# EAGLE schematic IR (EAGLE 9.4.2)
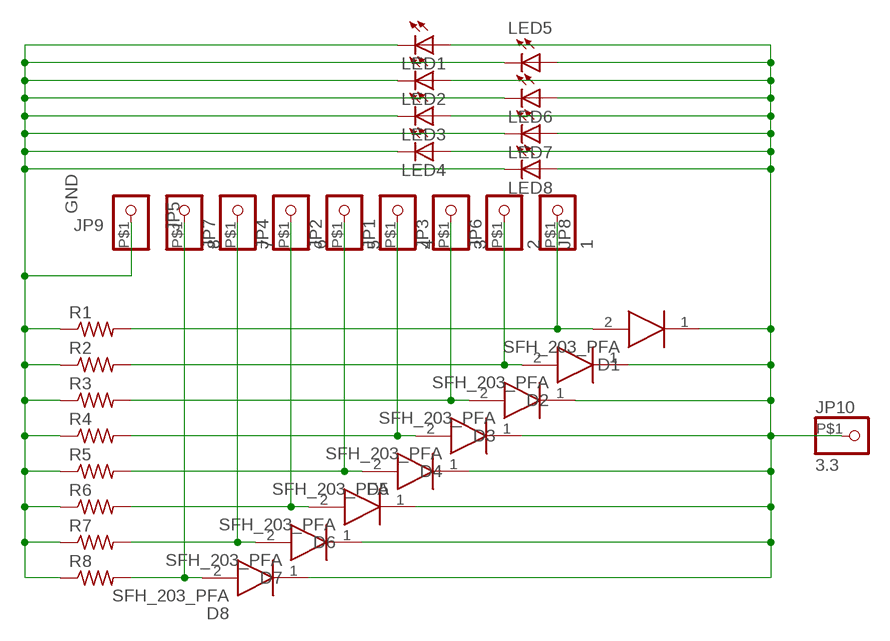
[diagram p0: schematic, sheet 1]

## Parts
D1  SFH_203_PFA  [SFH213_1]
D2  SFH_203_PFA  [SFH213_1]
D3  SFH_203_PFA  [SFH213_1]
D4  SFH_203_PFA  [SFH213_1]
D5  SFH_203_PFA  [SFH213_1]
D6  SFH_203_PFA  [SFH213_1]
D7  SFH_203_PFA  [SFH213_1]
D8  SFH_203_PFA  [SFH213_1]
JP1  4  PINHD-1X1-BIGPOGO  [1X1-BIGPOGO]
JP2  5  PINHD-1X1-BIGPOGO  [1X1-BIGPOGO]
JP3  3  PINHD-1X1-BIGPOGO  [1X1-BIGPOGO]
JP4  6  PINHD-1X1-BIGPOGO  [1X1-BIGPOGO]
JP5  8  PINHD-1X1-BIGPOGO  [1X1-BIGPOGO]
JP6  2  PINHD-1X1-BIGPOGO  [1X1-BIGPOGO]
JP7  7  PINHD-1X1-BIGPOGO  [1X1-BIGPOGO]
JP8  1  PINHD-1X1-BIGPOGO  [1X1-BIGPOGO]
JP9  GND  PINHD-1X1-BIGPOGO  [1X1-BIGPOGO]
JP10  3.3  PINHD-1X1-BIGPOGO  [1X1-BIGPOGO]
LED1  LED5MM  [LED5MM]
LED2  LED5MM  [LED5MM]
LED3  LED5MM  [LED5MM]
LED4  LED5MM  [LED5MM]
LED5  LED5MM  [LED5MM]
LED6  LED5MM  [LED5MM]
LED7  LED5MM  [LED5MM]
LED8  LED5MM  [LED5MM]
R1  R-US_0207/10  [0207/10]
R2  R-US_0207/10  [0207/10]
R3  R-US_0207/10  [0207/10]
R4  R-US_0207/10  [0207/10]
R5  R-US_0207/10  [0207/10]
R6  R-US_0207/10  [0207/10]
R7  R-US_0207/10  [0207/10]
R8  R-US_0207/10  [0207/10]

## Nets
N$1: D1.2(A) JP8.P$1 R1.2
N$2: D2.2(A) JP6.P$1 R2.2
N$3: D3.2(A) JP3.P$1 R3.2
N$4: D4.2(A) JP1.P$1 R4.2
N$5: D5.2(A) JP2.P$1 R5.2
N$6: D6.2(A) JP4.P$1 R6.2
N$7: D7.2(A) JP7.P$1 R7.2
N$8: D8.2(A) JP5.P$1 R8.2
N$9: D1.1(K) D2.1(K) D3.1(K) D4.1(K) D5.1(K) D6.1(K) D7.1(K) D8.1(K) JP10.P$1 LED1.A LED2.A LED3.A LED4.A LED5.A LED6.A LED7.A LED8.A
N$10: JP9.P$1 LED1.K(C) LED2.K(C) LED3.K(C) LED4.K(C) LED5.K(C) LED6.K(C) LED7.K(C) LED8.K(C) R1.1 R2.1 R3.1 R4.1 R5.1 R6.1 R7.1 R8.1

## Library data of the parts
D1-D8 = SFH_203_PFA:SFH_203_PFA: IR T-1 PIN Photodiode 150,SFH203PFA Osram Opto SFH 203 PFA IR Si Photodiode, 75 , Through Hole 5mm package Source: Datasheet <https://www.osram.com/media/resource/hires/osram-dam-2495938/SFH 203 PFA.pdf>; ALLIED_NUMBER: 70339002; ALLIED_PRICE-STOCK: https://www.alliedelec.com/osram-opto-semiconductors-sfh-203-pfa/70339002/; DESCRIPTION: IR T-1 PIN Photodiode 150,SFH203PFA Osram Opto SFH 203 PFA IR Si Photodiode, 75 , Through Hole 5mm package; HEIGHT: mm; MANUFACTURER_NAME: OSRAM Opto Semiconductors; MANUFACTURER_PART_NUMBER: SFH 203 PFA; MOUSER_PART_NUMBER: 720-SFH203PFA; MOUSER_PRICE-STOCK: https://www.mouser.com/Search/Refine.aspx?Keyword=720-SFH203PFA; RS_PART_NUMBER: 6548665; RS_PRICE-STOCK: https://uk.rs-online.com/web/p/products/6548665
JP1-JP10 = adafruit:PINHD-1X1: Pin header 1x1 for 0.1" spacing With round pins
LED1-LED8 = adafruit:LED: LED OSRAM: - CHIPLED LG R971, LG N971, LY N971, LG Q971, LY Q971, LO R971, LY R971 LH N974, LH R974 LS Q976, LO Q976, LY Q976 LO Q996 - Hyper CHIPLED LW Q18S LB Q993, LB Q99A, LB R99A - SideLED LS A670, LO A670, LY A670, LG A670, LP A670 LB A673, LV A673, LT A673, LW A673 LH A674 LY A675 LS A676, LA A676, LO A676, LY A676, LW A676 LS A679, LY A679, LG A679 - Hyper Micro SIDELED® LS Y876, LA Y876, LO Y876, LY Y876 LT Y87S - SmartLED LW L88C, LW L88S LB L89C, LB L89S, LG L890 LS L89K, LO L89K, LY L89K LS L896, LA L896, LO L896, LY L896 - TOPLED LS T670, LO T670, LY T670, LG T670, LP T670 LSG T670, LSP T670, LSY T670, LOP T670, LYG T670 LG T671, LOG T671, LSG T671 LB T673, LV T673, LT T673, LW T673 LH T674 LS T676, LA T676, LO T676, LY T676, LB T676, LH T676, LSB T676, LW T676 LB T67C, LV T67C, LT T67C, LS T67K, LO T67K, LY T67K, LW E67C LS E67B, LA E67B, LO E67B, LY E67B, LB E67C, LV E67C, LT E67C LW T67C LS T679, LY T679, LG T679 LS T770, LO T770, LY T770, LG T770, LP T770 LB T773, LV T773, LT T773, LW T773 LH T774 LS E675, LA E675, LY E675, LS T675 LS T776, LA T776, LO T776, LY T776, LB T776 LHGB T686 LT T68C, LB T68C - Hyper Mini TOPLED® LB M676 - Mini TOPLED Santana® LG M470 LS M47K, LO M47K, LY M47K Source: http://www.osram.convergy.de/
R1-R8 = adafruit:R-US_: RESISTOR, American symbol